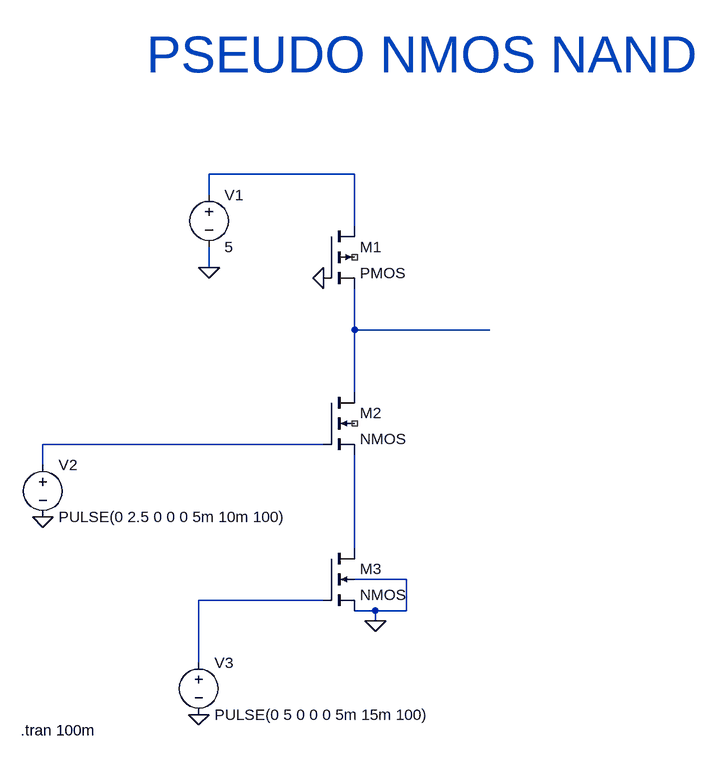
[diagram p0: schematic PSEUDO NMOS NAND.asc]
PSEUDO NMOS NAND.asc, the LTspice schematic file:
Version 4
SHEET 1 880 792
WIRE 176 -80 -48 -80
WIRE -48 -48 -48 -80
WIRE 176 0 176 -80
WIRE -48 64 -48 32
WIRE 176 160 176 96
WIRE 384 160 176 160
WIRE 176 256 176 160
WIRE 128 336 -304 336
WIRE -304 368 -304 336
WIRE 176 496 176 352
WIRE 256 544 176 544
WIRE 128 576 -64 576
WIRE 208 592 176 592
WIRE 256 592 256 544
WIRE 256 592 208 592
WIRE 208 608 208 592
WIRE -64 672 -64 576
FLAG 128 80 0
FLAG 208 608 0
FLAG -48 64 0
FLAG -304 448 0
FLAG -64 752 0
SYMBOL pmos4 128 0 R0
SYMATTR InstName M1
SYMBOL nmos4 128 256 R0
SYMATTR InstName M2
SYMBOL nmos4 128 496 R0
SYMATTR InstName M3
SYMBOL voltage -48 -64 R0
SYMATTR InstName V1
SYMATTR Value 5
SYMBOL voltage -304 352 R0
WINDOW 123 0 0 Left 0
WINDOW 39 0 0 Left 0
SYMATTR InstName V2
SYMATTR Value PULSE(0 2.5 0 0 0 5m 10m 100)
SYMBOL voltage -64 656 R0
SYMATTR InstName V3
SYMATTR Value PULSE(0 5 0 0 0 5m 15m 100)
TEXT -338 776 Left 2 !.tran 100m
TEXT -144 -264 Left 6 ;PSEUDO NMOS NAND

The netlist it stands for:
* PSEUDO NMOS NAND.asc
M1 N001 0 N002 NC_01 PMOS
M2 N002 N003 N004 NC_02 NMOS
M3 N004 N005 0 0 NMOS
V1 N001 0 5
V2 N003 0 PULSE(0 2.5 0 0 0 5m 10m 100)
V3 N005 0 PULSE(0 5 0 0 0 5m 15m 100)
.model NMOS NMOS
.model PMOS PMOS
.lib standard.mos
.tran 100m
* PSEUDO NMOS NAND
.backanno
.end